# EAGLE design 555flasher (EAGLE 9.6.1)
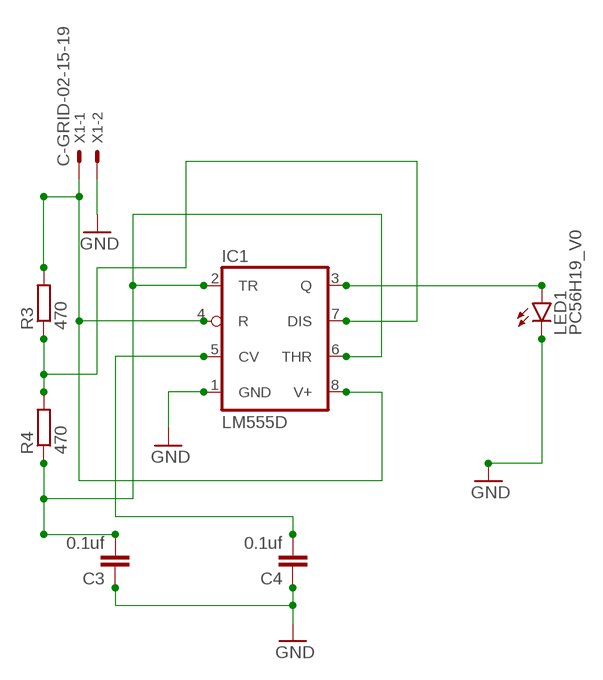
[diagram p0: schematic, sheet 1]

## Parts
C3  0.1uf  C-EUC0805  [C0805]
C4  0.1uf  C-EUC0805  [C0805]
IC1  LM555D  [SO08]
LED1  PC56H19_V0  [PC56H19_V0]
R3  470  R-EU_R0805  [R0805]
R4  470  R-EU_R0805  [R0805]
X1  C-GRID-02-15-19  [15-91-02]

## Nets
GND: C3.1 C4.1 IC1.1(GND) LED1.1(C) LED1.3(C) X1.2
N$1: IC1.4(R) IC1.8(V+) R3.2 X1.1
N$3: C4.2 IC1.5(CV)
N$4: IC1.7(DIS) R3.1 R4.2
N$5: C3.2 IC1.2(TR) IC1.6(THR) R4.1
N$9: IC1.3(Q) LED1.2(A) LED1.4(A)

## Library data of the parts
C3 C4 = rcl:C-EU: CAPACITOR, European symbol; SPICEPREFIX: C
IC1 = linear:*555: TIMER
LED1 = led:PC56H19_V0: Lextar white SMD LED Source: PC56H19_20150317.pdf www.lextar.com
R3 R4 = rcl:R-EU_: RESISTOR, European symbol; SPICEPREFIX: R
X1 = con-molex:C-GRID-02: CONNECTOR wire to board 2.54 mm (0.100") pitch header; MF: MOLEX; OC_FARNELL: unknown; OC_NEWARK: unknown

## Board
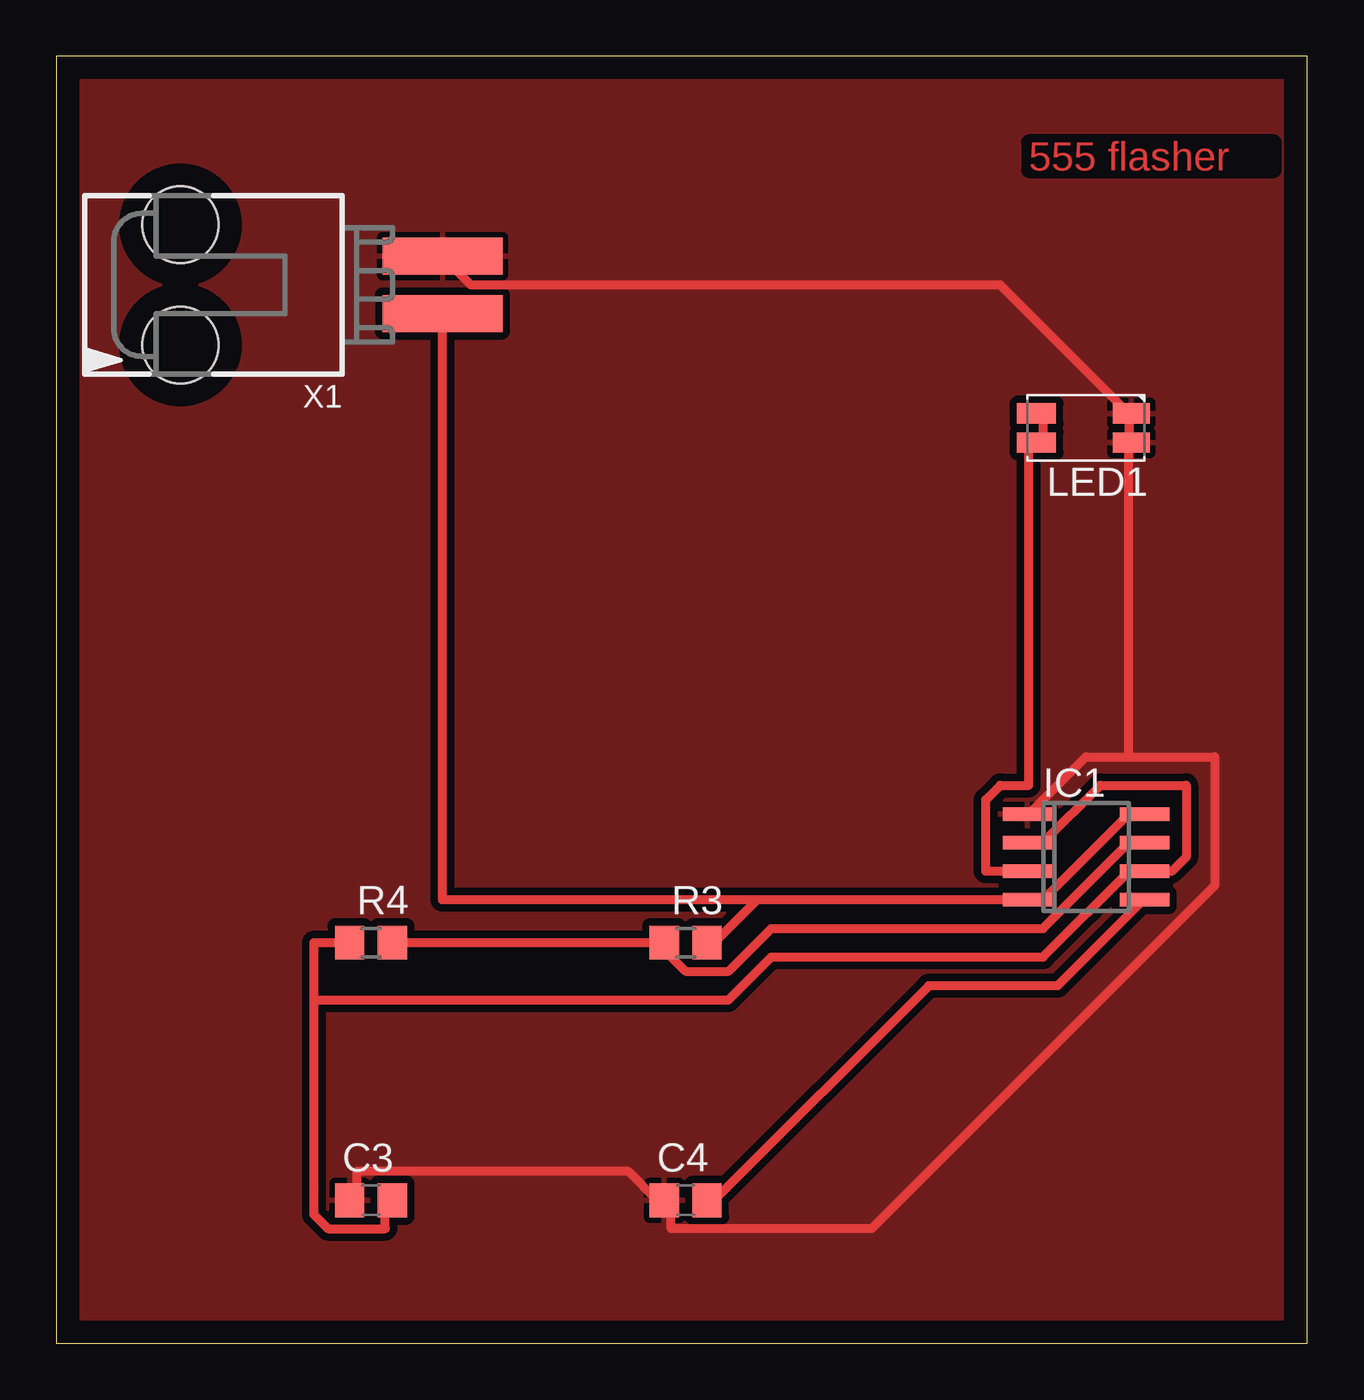
[diagram p1: board, top side]

Size 55.55 x 57.14 mm. Coordinates in mm from the lower left corner, seen from the top.
Outline: 0,0 55.55,0 55.55,57.14 0,57.14 0,0
Copper layers (1*16): Top 0.035mm / dielectric 1.5mm / Bottom 0.035mm
Design rules "default *": minimum track width 20mil, minimum drill 0.35mm, track to track 13mil, track to pad 6mil, pad to pad 6mil, via to via 6mil, smd to smd 6mil, copper to edge 40mil, drill to drill 6mil, minimum pad ring 10mil, minimum via ring 8mil, stop-mask expansion 4mil, vias tented up to drill 0mil, thermal gap 10mil

### Footprints (pad centres in the part's own frame; a part is rotated, then mirrored left to right if it is on the bottom)
C0805 = smd 1.3 x 1.5: 1 -0.95,0; 2 0.95,0
SO08 = smd 0.6 x 2.2: 1 -1.905,-2.6; 2 -0.635,-2.6; 3 0.635,-2.6; 4 1.905,-2.6; 5 1.905,2.6; 6 0.635,2.6; 7 -0.635,2.6; 8 -1.905,2.6
PC56H19_V0 = smd 1.63 x 0.9: 1 -2.01,0.65; 3 -2.01,-0.645 | smd 1.73 x 0.9: 2 2.195,0.65; 4 2.195,-0.65
R0805 = smd 1.3 x 1.5: 1 -0.95,0; 2 0.95,0
15-91-02 = smd 1.651 x 5.334: 1 -1.27,-10.795; 2 1.27,-10.795 | hole 3.404: -2.667,0.838; 2.667,0.838

### Placement (x,y rotation side)
C3  13.97,6.35 0 top
C4  27.94,6.35 0 top
IC1  45.72,21.59 270 top
LED1  45.72,40.64 180 top
R3  27.94,17.78 0 top
R4  13.97,17.78 0 top
X1  6.35,46.99 90 top

### Tracks (layer width: path | path; a pad name or v marks a point on that pad's centre or on a via)
GND
  Top 0.406: C3.1 13.34,6.35 13.34,7.62 25.4,7.62 26.67,6.35 C4.1 27.3,6.35 27.3,5.08 36.2,5.08 51.43,20.32 51.43,26.04 47.62,26.04 | 47.62,41.28 47.62,40.01 | 47.62,26.04 47.62,40.01 | 47.62,26.04 45.72,26.04 43.18,23.49 IC1.1 | 47.62,40.01 LED1.1 | X1.2 18.41,46.99 41.91,46.99 47.62,41.28 | 47.62,41.28 LED1.3
  pour Top: 0,57.15 55.88,57.15 55.88,0 0,0
N$1
  Top 0.406: 31.11,19.69 29.21,17.78 R3.2 | 31.11,19.69 IC1.4 43.81,19.69 47.62,23.49 IC1.8 | X1.1 17.14,19.69 31.11,19.69
N$3
  Top 0.406: C4.2 29.21,6.35 38.73,15.88 44.45,15.88 48.26,19.69 IC1.5
N$4
  Top 0.406: 26.67,17.78 R4.2 | IC1.7 47.62,22.23 43.81,18.41 31.75,18.41 29.84,16.51 27.94,16.51 26.67,17.78 | 26.67,17.78 R3.1
N$5
  Top 0.406: IC1.2 43.81,22.23 46.35,24.77 50.16,24.77 50.16,21.59 49.53,20.95 IC1.6 47.62,20.95 43.81,17.15 31.75,17.15 29.84,15.24 11.43,15.24 | 11.43,15.24 11.43,17.78 R4.1 | 11.43,15.24 11.43,5.71 12.07,5.08 14.61,5.08 14.61,6.35 C3.2
N$9
  Top 0.406: LED1.4 43.81,41.28 43.81,40.01 LED1.2 43.18,40.01 43.18,24.77 41.91,24.77 41.27,24.13 41.27,20.95 IC1.3

### Text on the board
Top: 555 flasher